# Altium project nrf5340_Cam.PrjPCB
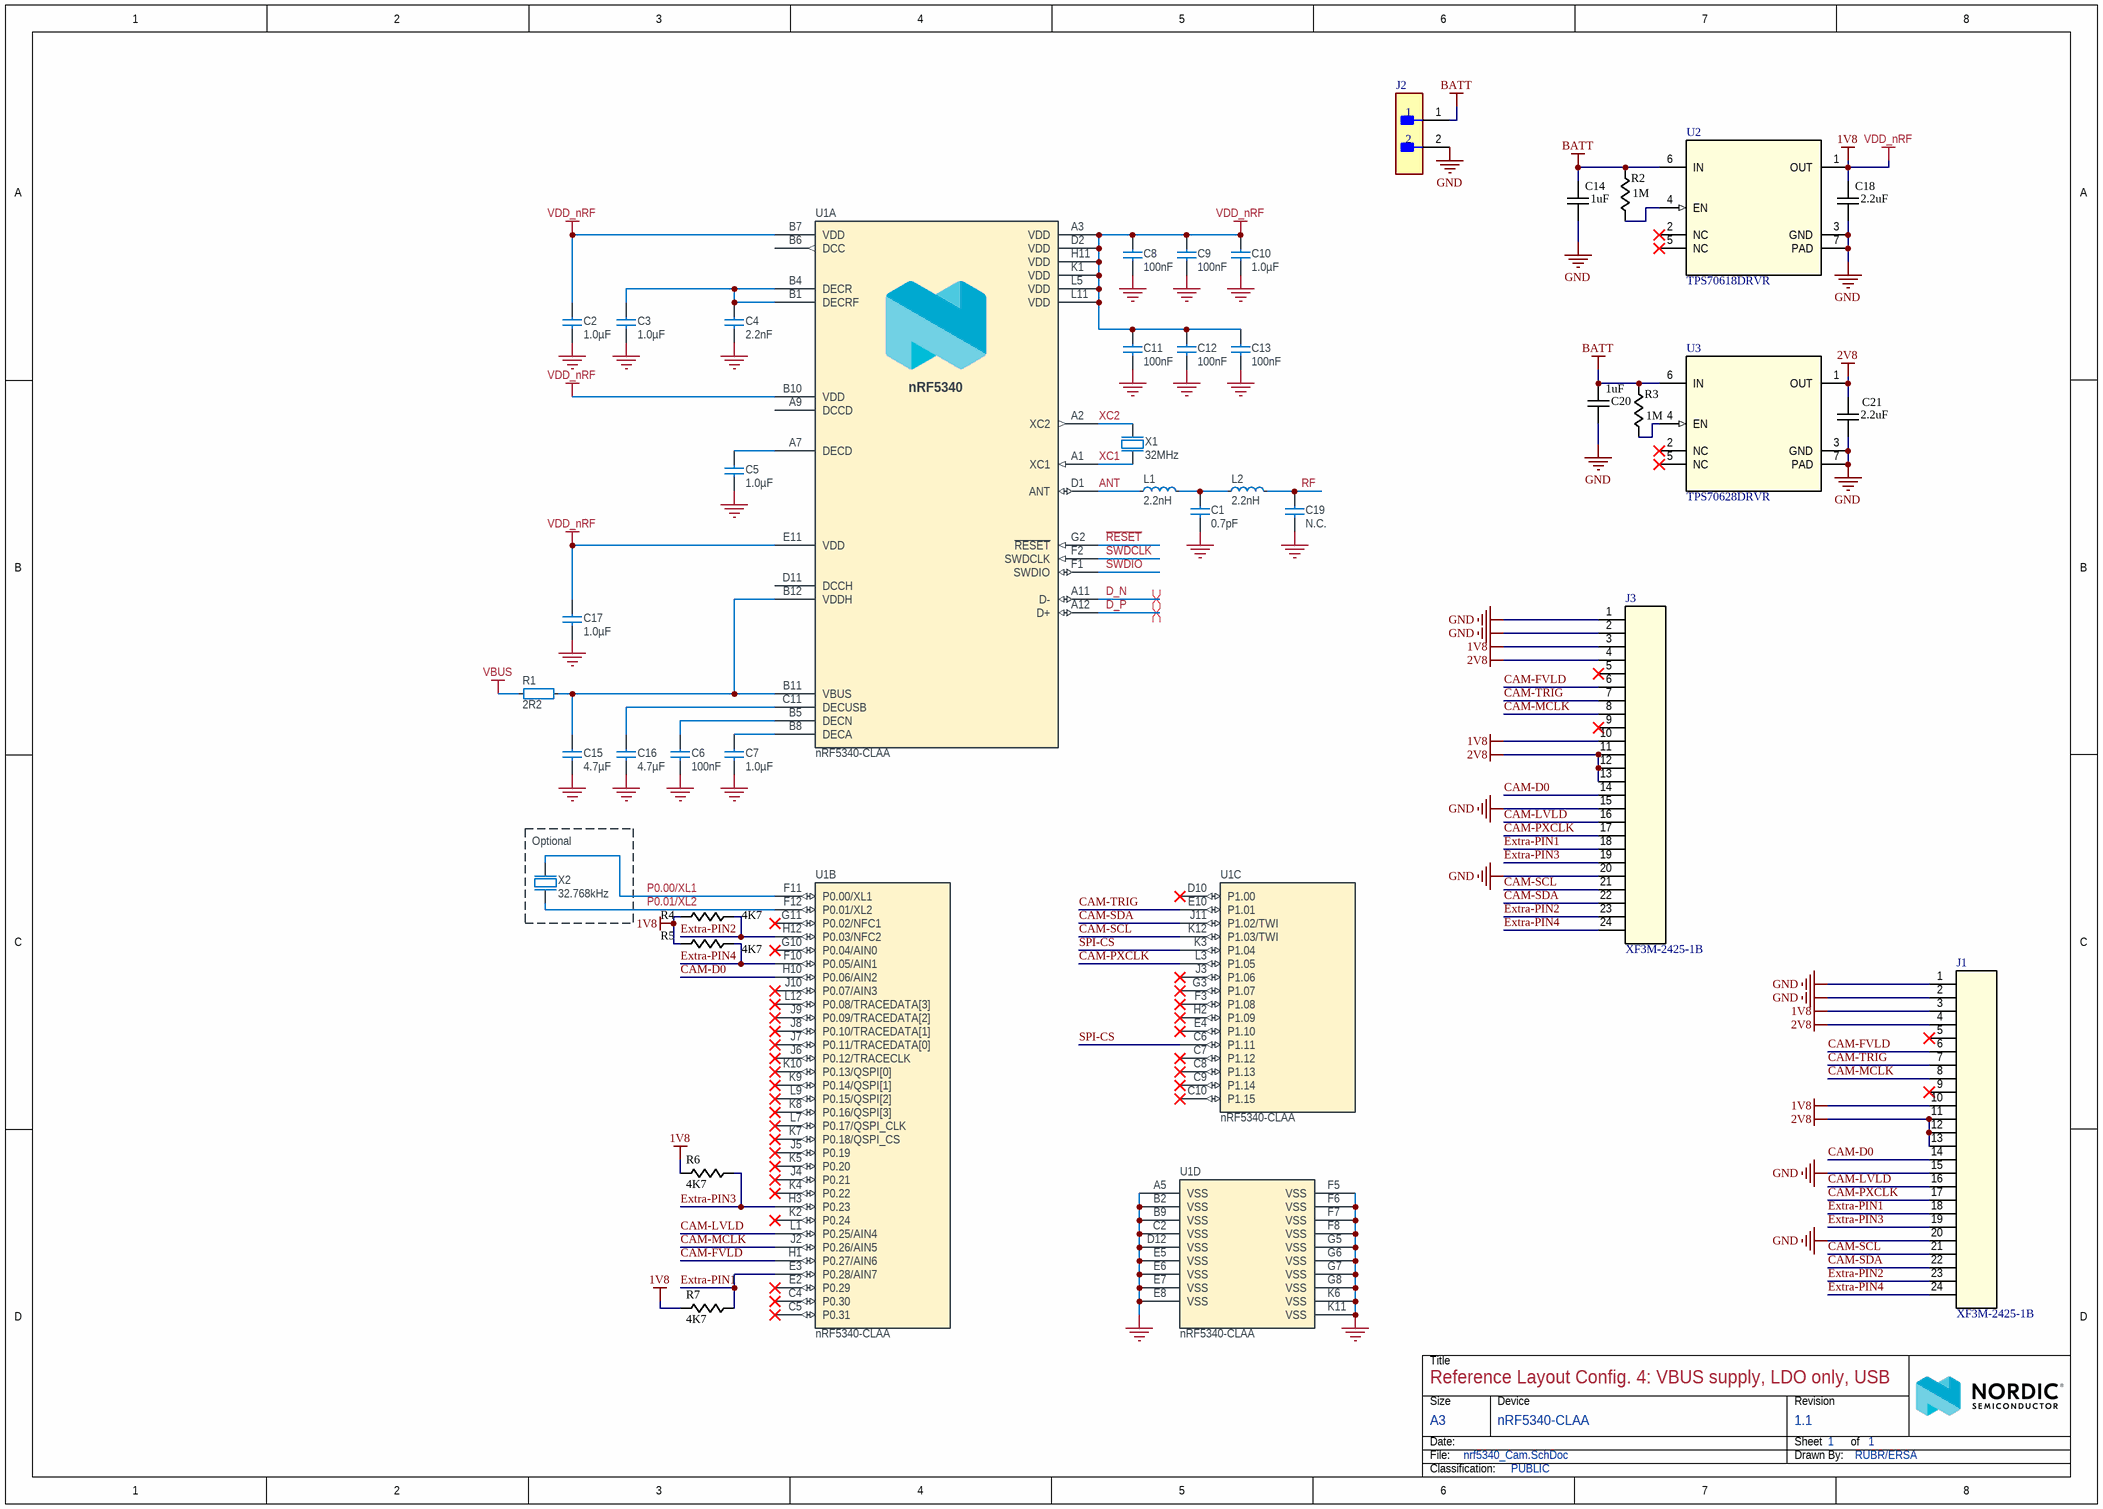
[diagram p0: nrf5340_Cam.SchDoc]
1 sheet, 38 parts. Net scope: global (net labels, ports and power ports of the same name join across sheets).
Board file: nrf5340_Cam.PcbDoc

## Sheet nrf5340_Cam.SchDoc
size A3; Organization: Nordic Semiconductor; DocumentNumber: 1; Revision: 1.1; SheetNumber: 1; SheetTotal: 1; DrawnBy: RUBR/ERSA; DocumentSize: A3; RefLayoutTitle: Reference Layout Config. 4: VBUS supply, LDO only, USB; Device: nRF5340-CLAA; Classification: PUBLIC; ProjectName: nrf5340_Cam.PrjPCB

### Parts
C1  0.7pF  [CAPC0603X03L_C]
C2  1.0µF  [CAPC1005X04L]
C3  1.0µF  [CAPC1005X04L]
C4  2.2nF  [CAPC0603X03L_C]
C5  1.0µF  [CAPC1005X04L]
C6  100nF  [CAPC0603X03L_C]
C7  1.0µF  [CAPC1005X04L]
C8  100nF  [CAPC0603X03L_C]
C9  100nF  [CAPC0603X03L_C]
C10  1.0µF  [CAPC1005X04L]
C11  100nF  [CAPC0603X03L_C]
C12  100nF  [CAPC0603X03L_C]
C13  100nF  [CAPC0603X03L_C]
C14  value 1uF  [PCB-CAP-SMD-0402]  (hidden comment: CAP-SMD)
C15  4.7µF  [CAPC1608X06L]
C16  4.7µF  [CAPC1608X06L]
C17  1.0µF  [CAPC1005X04L]
C18  value 2.2uF  [PCB-CAP-SMD-0402]  (hidden comment: CAP-SMD)
C19  N.C.  [CAPC0603X03L_C_NC]
C20  value 1uF  [PCB-CAP-SMD-0402]  (hidden comment: CAP-SMD)
C21  value 2.2uF  [PCB-CAP-SMD-0402]  (hidden comment: CAP-SMD)
J1  XF3M-2425-1B  [CONN_XF3M-24_OMR]
J2  53047-0210  [FP-53047-0210-MFG]  (value not drawn)
J3  XF3M-2425-1B  [CONN_XF3M-24_OMR]
L1  2.2nH  [INDC0603X03L_C]
L2  2.2nH  [INDC0603X03L_C]
R1  2R2  [RESC0603X03L_C]
R2  value 1M  [PCB-RES-SMA-0402]  (hidden comment: RES-SMD-0402)
R3  value 1M  [PCB-RES-SMA-0402]  (hidden comment: RES-SMD-0402)
R4  value 4K7  [PCB-RES-SMA-0402]  (hidden comment: RES-SMD-0402)
R5  value 4K7  [PCB-RES-SMA-0402]  (hidden comment: RES-SMD-0402)
R6  value 4K7  [PCB-RES-SMA-0402]  (hidden comment: RES-SMD-0402)
R7  value 4K7  [PCB-RES-SMA-0402]  (hidden comment: RES-SMD-0402)
U1  nRF5340-CLAA  [BGA95C35P12X11_437X397X50]  (parts A,B,C,D of 4)
U2  TPS70618DRVR  [DRV0006A]
U3  TPS70628DRVR  [DRV0006A]
X1  32MHz  [BT-XTAL_2016]
X2  32.768kHz  [XTAL_2012]

### Blocks framed on the sheet
Optional: X2

### Nets
1V8: C2.1 C8.1 C9.1 C10.1 C11.1 C12.1 C13.1 C17.1 C18.2 J1.3 J1.10 J3.3 J3.10 R4.2 R5.2 R6.1 R7.1 U1.A3(VDD) U1.B7(VDD) U1.B10(VDD) U1.D2(VDD) U1.E11(VDD) U1.H11(VDD) U1.K1(VDD) U1.L5(VDD) U1.L11(VDD) U2.1(OUT)  [also labelled VDD_nRF]
2V8: C21.2 J1.4 J1.11 J1.12 J1.13 J3.4 J3.11 J3.12 J3.13 U3.1(OUT)
BATT: C14.2 C20.2 J2.1 R2.2 R3.2 U2.6(IN) U3.6(IN)
GND: C1.1 C2.2 C3.1 C4.2 C5.1 C6.2 C7.1 C8.2 C9.2 C10.2 C11.2 C12.2 C13.2 C14.1 C15.2 C16.2 C17.2 C18.1 C19.1 C20.1 C21.1 J1.1 J1.2 J1.15 J1.20 J2.2 J3.1 J3.2 J3.15 J3.20 U1.A5(VSS) U1.B2(VSS) U1.B9(VSS) U1.C2(VSS) U1.D12(VSS) U1.E5(VSS) U1.E6(VSS) U1.E7(VSS) U1.E8(VSS) U1.F5(VSS) U1.F6(VSS) U1.F7(VSS) U1.F8(VSS) U1.G5(VSS) U1.G6(VSS) U1.G7(VSS) U1.G8(VSS) U1.K6(VSS) U1.K11(VSS) U2.3(GND) U2.7(PAD) U3.3(GND) U3.7(PAD) X1.2(GND) X1.4(GND)
VBUS: R1.1
ANT: L1.2 U1.D1(ANT)
CAM-D0: J1.14 J3.14 U1.H10(P0.06/AIN2)
CAM-FVLD: J1.6 J3.6 U1.H1(P0.27/AIN6)
CAM-LVLD: J1.16 J3.16 U1.L1(P0.25/AIN4)
CAM-MCLK: J1.8 J3.8 U1.J2(P0.26/AIN5)
CAM-PXCLK: J1.17 J3.17 U1.L3(P1.05)
CAM-SCL: J1.21 J3.21 U1.K12(P1.03/TWI)
CAM-SDA: J1.22 J3.22 U1.J11(P1.02/TWI)
CAM-TRIG: J1.7 J3.7 U1.E10(P1.01)
D_N: U1.A11(D-)
D_P: U1.A12(D+)
Extra-PIN1: J1.18 J3.18 R7.2 U1.E3(P0.28/AIN7)
Extra-PIN2: J1.23 J3.23 R4.1 U1.H12(P0.03/NFC2)
Extra-PIN3: J1.19 J3.19 R6.2 U1.H3(P0.23)
Extra-PIN4: J1.24 J3.24 R5.1 U1.F10(P0.05/AIN1)
P0.00/XL1: U1.F11(P0.00/XL1) X2.1(inp)
P0.01/XL2: U1.F12(P0.01/XL2) X2.2(out)
~{RESET}: U1.G2(~{RESET})
RF: C19.2 L2.1
SPI-CS: U1.C6(P1.11) U1.K3(P1.04)
SWDCLK: U1.F2(SWDCLK)
SWDIO: U1.F1(SWDIO)
XC1: U1.A1(XC1) X1.1(inp)
XC2: U1.A2(XC2) X1.3(out)
NetC1_2: C1.2 L1.1 L2.2
NetC3_2: C3.2 C4.1 U1.B1(DECRF) U1.B4(DECR)
NetC5_2: C5.2 U1.A7(DECD)
NetC6_1: C6.1 U1.B5(DECN)
NetC7_2: C7.2 U1.B8(DECA)
NetC15_1: C15.1 R1.2 U1.B11(VBUS) U1.B12(VDDH)
NetC16_1: C16.1 U1.C11(DECUSB)
NetR2_1: R2.1 U2.4(EN)
NetR3_1: R3.1 U3.4(EN)

Not connected (* = marked no-connect by the designer): J1 5* 9*; J3 5* 9*; U1 A9(DCCD) B6(DCC) C4(P0.30)* C5(P0.31)* C7(P1.12)* C8(P1.13)* C9(P1.14)* C10(P1.15)* D10(P1.00)* D11(DCCH) E2(P0.29)* E4(P1.10)* F3(P1.08)* G3(P1.07)* G10(P0.04/AIN0)* G11(P0.02/NFC1)* H2(P1.09)* J3(P1.06)* J4(P0.21)* J5(P0.19)* J6(P0.12/TRACECLK)* J7(P0.11/TRACEDATA[0])* J8(P0.10/TRACEDATA[1])* J9(P0.09/TRACEDATA[2])* J10(P0.07/AIN3)* K2(P0.24)* K4(P0.22)* K5(P0.20)* K7(P0.18/QSPI_CS)* K8(P0.16/QSPI[3])* K9(P0.14/QSPI[1])* K10(P0.13/QSPI[0])* L7(P0.17/QSPI_CLK)* L9(P0.15/QSPI[2])* L12(P0.08/TRACEDATA[3])*; U2 2(NC)* 5(NC)*; U3 2(NC)* 5(NC)*

### Layout directives
differential pair: D_N, D_P

### Notes on the sheet
- Title
- Size
- Date:
- File:
- A3
- Device
- Sheet         of
- Drawn By:
- Revision
- Classification:
- (in symbol nRF5340-CLAA, part A) nRF5340

### Library data of the parts
C1 = C0201-0.7p: Capacitor, NP0, ±0.05pF; Pad Count: 2; Value: 0.7pF; Footprint Doc: 0201; Component Class: Capacitors; Author: rsk
C2 C3 C5 C7 C10 C17 = C0402-1µ0-10V-X7S-GRM155C71A105KE11: Capacitor, X7S, ±10%; Pad Count: 2; Value: 1.0µF; Footprint Doc: 0402; Component Class: Capacitors; Author: prbu
C4 = C0201-2n2: Capacitor, X7R, ±10%; Pad Count: 2; Value: 2.2nF; Footprint Doc: 0201; Component Class: Capacitors; Author: rsk
C6 C8 C9 C11-C13 = C0201-100n-16V-X7S: Capacitor, X7S, ±10%; Pad Count: 2; Value: 100nF; Footprint Doc: 0201; Component Class: Capacitors; Author: rsk
C14 C18 C20 C21 = CMP-00016-4: Generica (no part number) surface mount capacitor.
C15 = C0603-4µ7-10V-X7S: Capacitor, X7S, ±10%; Pad Count: 2; Value: 4.7µF; Footprint Doc: 0603; Component Class: Capacitors; Author: rsk
C16 = C0603-4µ7-6.3V-X7R: Capacitor, X7R, ±10%; Pad Count: 2; Value: 4.7µF; Footprint Doc: 0603; Component Class: Capacitors; Author: rsk
C19 = C0201-N.C.: Not mounted; Assembly: Not mounted; Pad Count: 2; Value: N.C.; Footprint Doc: 0201; Component Class: Capacitors; Author: rsk
J1 J3 = CMP-142-000000-2: No Description Available; Mfr_Name: Omron; Design Item ID: XF3M-2425-1B; Source: XF3M-2425-1B.SchLib; Type: Type; RefDes: RefDes; Component Type: Standard; Pin Count: 24
J2 = CMP-00153-2: Board Connector, 2 Contact(s), 1 Row(s), Male, Straight, 0.049 inch Pitch, Solder Terminal, Locking, White Insulator, Receptacle; Number Of PCB Rows: 1; Filter Feature: No; Contact Style: Blade Pin; Mating Information: MULTIPLE MATING PARTS AVAILABLE; Reliability: COMMERCIAL; Reference Standard: UL; Body Length: 0.167inch; Option: General Purpose; Body Depth: 0.165inch; Number of Contacts: 2; PCB Contact Pattern: RECTANGULAR; Body Breadth: 0.126inch; Polarization Key: POLARIZED HOUSING; Contact Finish - Termination: Tin (Sn); Mounting Option 1: LOCKING; Mating Contact Pitch: 0.049inch; Flammability Rating: UL94 V-0; RoHS Compliant: Yes; Mixed Contacts: No; Contact Gender: Male; Terminal Length: 0.09inch; Insulation Material: Nylon; DIN Conformance: No; IEC Conformance: No; Body/Shell Style: RECEPTACLE; Mounting Technology: Board; Number of Rows Loaded: 1; MIL Conformance: No; Contact Finish - Mating: TIN; Number Of Connectors: 1; Insulation Color: White; Mounting Style: STRAIGHT; Connector Type: BOARD CONNECTOR; Contact Pattern: RECTANGULAR; Termination: Solder; Reach SVHC Compliant: Yes; Terminal Pitch: 1.25mm; JESD-609 Code: e3
L1 L2 = L0201-2n2: High frequency chip inductor, ±5%; Pad Count: 2; Footprint Doc: 0201; Value: 2.2nH; Component Class: Inductors; Author: rsk
R1 = R0201-2R2: Resistor, ±1%, 0.05W; Pad Count: 2; Footprint Doc: 0201; Value: 2R2; Component Class: Resistors; Author: rsk
R2-R7 = CMP-00001-5: Generic (no part number) 0402 surface mount resistor
U1 = nRF5340-CLAA: Multi-protocol Bluetooth Low Energy, IEEE 802.15.4, ANT and 2.4GHz proprietary system-on-chip; Pad Count: 95; Footprint Doc: WLCSP-95; Value: nRF5340-CLAA; Component Class: nRF_Devices; Author: rsk
U2 = CMP-277-000001-1: No Description Available; Manufacturer: Texas Instruments; PartNumber: TPS70612DRVR; Alternate_PartNumber: TPS70612DRVT; CompType: IC; RoHS: Y; Design Item ID: TPS70618DRVR; Source: TPS70618DRVR.SchLib; Application_BuildNumber: *; RefDes: RefDes; MountType: SMT; TYPE: TYPE; Mfr_Name: Texas Instruments; PackageReference: DRV0006A
U3 = CMP-026-000004-1: Fixed Positive LDO Regulator, 2.8V, 1.54V Dropout, PDSO6; Manufacturer: Texas Instruments; Alternate_PartNumber: TPS70612DRVT; PartNumber: TPS70612DRVR; Regulator Type: FIXED POSITIVE MULTIPLE OUTPUT LDO REGULATOR; CompType: IC; TYPE: TYPE; Design Item ID: TPS70618DRVR; RoHS: Y; Mfr_Name: Texas Instruments; Reach SVHC Compliant: Yes; Moisture Sensitivity Level: 1; JESD-609 Code: e4; RoHS Compliant: Yes; PackageReference: DRV0006A; Application_BuildNumber: *; Source: TPS70618DRVR.SchLib; MountType: SMT; RefDes: RefDes; Terminal Finish: Nickel
X1 = XTAL_SMD2016_32MHz_8pF_General: XTAL SMD 2016, 32MHz, Cl=8pF, Total Tol: ±30ppm; Pad Count: 4; Value: 32MHz; Footprint Doc: XTAL_2016; Component Class: Oscillators; Author: rsk
X2 = XTAL_SMD2012_32.768kHz_9pF_General: XTAL SMD 2012, 32.768kHz, Cl=9pF, Total Tol: ±50ppm; Pad Count: 2; Value: 32.768kHz; Footprint Doc: XTAL_2012; Component Class: Oscillators; Author: rsk